# Altium schematic sheet Radio.SchDoc
size A4
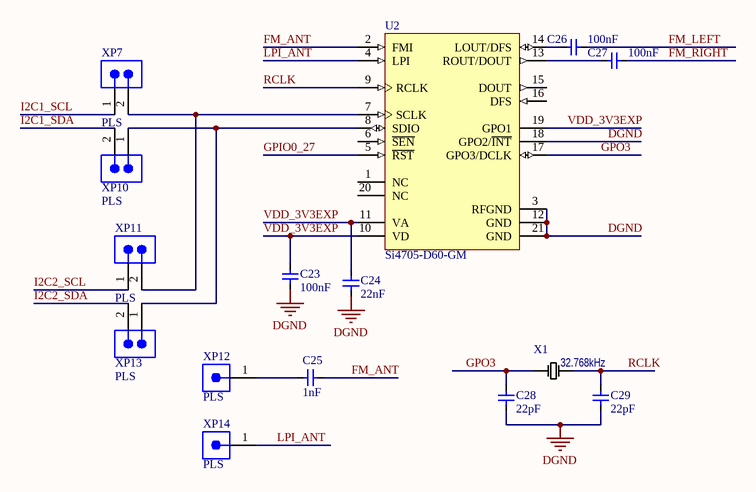
[diagram p0: Radio.SchDoc]

## Parts
C23  100nF  [CAP0603R]
C24  22nF  [CAP0603R]
C25  1nF  [CAP0603R]
C26  100nF  [CAP0603R]
C27  100nF  [CAP0603R]
C28  22pF  [CAP0603R]
C29  22pF  [CAP0603R]
U2  Si4705-D60-GM  [SLAB-QFN-20-1700x1700TP_V]
X1  32.768kHz  [5020]
XP7  PLS  [PLS-02]
XP10  PLS  [PLS-02]
XP11  PLS  [PLS-02]
XP12  PLS  [PLS-01]
XP13  PLS  [PLS-02]
XP14  PLS  [PLS-01]

## Nets
DGND: C23.1 C24.2 C28.1 C29.1 U2.3(RFGND) U2.12(GND) U2.18(GPO2/~{INT}) U2.21(GND)
FM_ANT: C25.2 U2.2(FMI)
FM_LEFT: C26.1
FM_RIGHT: C27.1
GPIO0_27: U2.5(~{RST})
GPO3: C28.2 U2.17(GPO3/DCLK) X1.1
I2C1_SCL: XP7.1
I2C1_SDA: XP10.2
I2C2_SCL: XP11.1
I2C2_SDA: XP13.2
LPI_ANT: U2.4(LPI) XP14.1
RCLK: C29.2 U2.9(RCLK) X1.2
VDD_3V3EXP: C23.2 C24.1 U2.10(VD) U2.11(VA) U2.19(GPO1)
NetC25_1: C25.1 XP12.1
NetC26_2: C26.2 U2.14(LOUT/DFS)
NetC27_2: C27.2 U2.13(ROUT/DOUT)
NetU2_7: U2.7(SCLK) XP7.2 XP11.2
NetU2_8: U2.8(SDIO) XP10.1 XP13.1

Not connected (* = marked no-connect by the designer): U2 1(NC) 6(~{SEN}) 15(DOUT) 16(DFS) 20(NC)

## Library data of the parts
C23 C26 C27 = CC0603_100NF_50V_10%_X7R: SMD 0805 Capacitor; Part Description: SMD Multilayer Chip Ceramic Capacitor; Manufacturer: GENERIC; Manufacturer1 Part Number: 223858615649; Voltage: 50V; TC: X7R; Tolerance: ±10%; Table: Capacitors SMD; Part Number: CC0603_100NF_50V_10%_X7R; Component Kind: Standard; Component Type: Standard; Pin Count: 2; Value: 100nF; Status: Preferred; Manufacturer Part Number: CC0603_100NF_50V_10%_X7R; Case: 0603; Mounted: Yes; Socket: No; SMD: Yes; Manufacturer1 Example: PHYCOMP; Manufacturer1 ComponentHeight: 0.87mm; HelpURL: \\cern.ch\dfs\Applications\Altium\Datasheets\CC0603_X7R_PHYCOMP.pdf; Author: I. Kuznetsov; CreateDate: 03.12.2007; LatestRevisionDate: 03.12.2007
C24 = CC0603_22NF_50V_10%_X7R: SMD 0805 Capacitor; Part Description: SMD Multilayer Chip Ceramic Capacitor; Manufacturer: GENERIC; Manufacturer1 Part Number: 223858615641; Voltage: 50V; TC: X7R; Tolerance: ±10%; Table: Capacitors SMD; Part Number: CC0603_22NF_50V_10%_X7R; Component Kind: Standard; Component Type: Standard; Pin Count: 2; Value: 22nF; Status: Preferred; Manufacturer Part Number: CC0603_22NF_50V_10%_X7R; Case: 0603; Mounted: Yes; Socket: No; SMD: Yes; Manufacturer1 Example: PHYCOMP; Manufacturer1 ComponentHeight: 0.87mm; HelpURL: \\cern.ch\dfs\Applications\Altium\Datasheets\CC0603_X7R_PHYCOMP.pdf; Author: I. Kuznetsov; CreateDate: 03.12.2007; LatestRevisionDate: 03.12.2007
C25 = CC0603_1NF_50V_10%_X7R: SMD 0805 Capacitor; Part Description: SMD Multilayer Chip Ceramic Capacitor; Manufacturer: GENERIC; Manufacturer1 Part Number: 223858615623; Voltage: 50V; TC: X7R; Tolerance: ±10%; Table: Capacitors SMD; Part Number: CC0603_1NF_50V_10%_X7R; Component Kind: Standard; Component Type: Standard; Pin Count: 2; Value: 1nF; Status: Preferred; Manufacturer Part Number: CC0603_1NF_50V_10%_X7R; Case: 0603; Mounted: Yes; Socket: No; SMD: Yes; Manufacturer1 Example: PHYCOMP; Manufacturer1 ComponentHeight: 0.87mm; HelpURL: \\cern.ch\dfs\Applications\Altium\Datasheets\CC0603_X7R_PHYCOMP.pdf; Author: I. Kuznetsov; CreateDate: 03.12.2007; LatestRevisionDate: 03.12.2007
C28 C29 = CC0603_22PF_50V_5%_NP0: SMD 0805 Capacitor; Part Description: SMD Multilayer Chip Ceramic Capacitor; Manufacturer: GENERIC; Manufacturer1 Part Number: 223886715229; Voltage: 50V; TC: NP0; Tolerance: ±5%; Table: Capacitors SMD; Part Number: CC0603_22PF_50V_5%_NP0; Component Kind: Standard; Component Type: Standard; Pin Count: 2; Value: 22pF; Status: Preferred; Manufacturer Part Number: CC0603_22PF_50V_5%_NP0; Case: 0603; Mounted: Yes; Socket: No; SMD: Yes; Manufacturer1 Example: PHYCOMP; Manufacturer1 ComponentHeight: 0.87mm; HelpURL: \\cern.ch\dfs\Applications\Altium\Datasheets\CC0603_NP0_PHYCOMP.pdf; Author: I. Kuznetsov; CreateDate: 03.12.2007; LatestRevisionDate: 03.12.2007
U2 = CMP-0501-00017-1: Broadcast FM Radio Receiver with RDS / RBDS, -20 to 85 degC, 20-pin QFN, Tray; Manufacturer: Silicon Labs; RDS Support: TRUE; Sub-Family: FM Receivers; ComponentLink2Description: Datasheet; ComponentLink3Description: Package Specification; DatasheetVersion: Rev. 1.2; ComponentLink1URL: http://www.silabs.com/; Code_IPC: J-STD-020; Mounting Technology: Surface Mount; ComponentLink2URL: http://www.silabs.com/Support%20Documents/TechnicalDocs/Si4704-05-D60.pdf; ComponentLink1Description: Manufacturer URL; Packing: Tray; ComponentLink3URL: http://www.silabs.com/Support%20Documents/TechnicalDocs/C8051F99x.pdf; PackageDescription: 20-Pin Quad-Flat No-Leads Package, Body 3 x 3 mm, Pitch 0.5 mm; PartNumber: Si4705-D60-GM; PackageReference: QFN-20
X1 = CC4V-T1A: Кварцевый резонатор; Table: Crystall; Part Number: CC4V-T1A; Device: CC4V-T1A; PackageDescription: 5.0 x 2.0 x 1.3mm Crystal; Value: 32.768kHz; Author: I. Kuznetsov
XP7 XP10 XP11 XP13 = PLS-02: Manufacturer: AUK; Part Number: PLS-02; Component Kind: Standard; Component Type: Standard; PackageDescription: PLS-02; Pin Count: 2; Family: PLS; SMD: No; Device: PLS-02; Manufacturer Part Number: PLS-02; Table: AUK
XP12 XP14 = PLS-01: Manufacturer: AUK; Part Number: PLS-01; Component Kind: Standard; Component Type: Standard; PackageDescription: PLS-01; Pin Count: 1; Family: PLS; SMD: Yes; Device: PLS-01; Manufacturer Part Number: PLS-01; Table: AUK